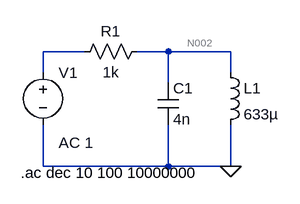
[diagram p0: schematic Task4.asc]
Task4.asc, the LTspice schematic file:
Version 4
SHEET 1 880 680
WIRE 128 32 64 32
WIRE 256 32 208 32
WIRE 352 32 256 32
WIRE 64 64 64 32
WIRE 352 64 352 32
WIRE 256 80 256 32
WIRE 64 208 64 144
WIRE 256 208 256 144
WIRE 256 208 64 208
WIRE 352 208 352 144
WIRE 352 208 256 208
FLAG 352 208 0
SYMBOL res 224 16 R90
WINDOW 0 0 56 VBottom 2
WINDOW 3 32 56 VTop 2
SYMATTR InstName R1
SYMATTR Value 1k
SYMBOL cap 240 80 R0
SYMATTR InstName C1
SYMATTR Value 4n
SYMBOL ind 336 48 R0
SYMATTR InstName L1
SYMATTR Value 633µ
SYMBOL voltage 64 48 R0
WINDOW 123 24 124 Left 2
WINDOW 39 0 0 Left 0
SYMATTR InstName V1
SYMATTR Value ""
SYMATTR Value2 AC 1
TEXT 30 218 Left 2 !.ac dec 10 100 10000000

The netlist it stands for:
* Task4.asc
R1 N002 N001 1k
C1 N002 0 4n
L1 N002 0 633µ
V1 N001 0 AC 1
.ac dec 10 100 10000000
.backanno
.end

* Results of the author's LTspice run, read from the files saved beside the schematic
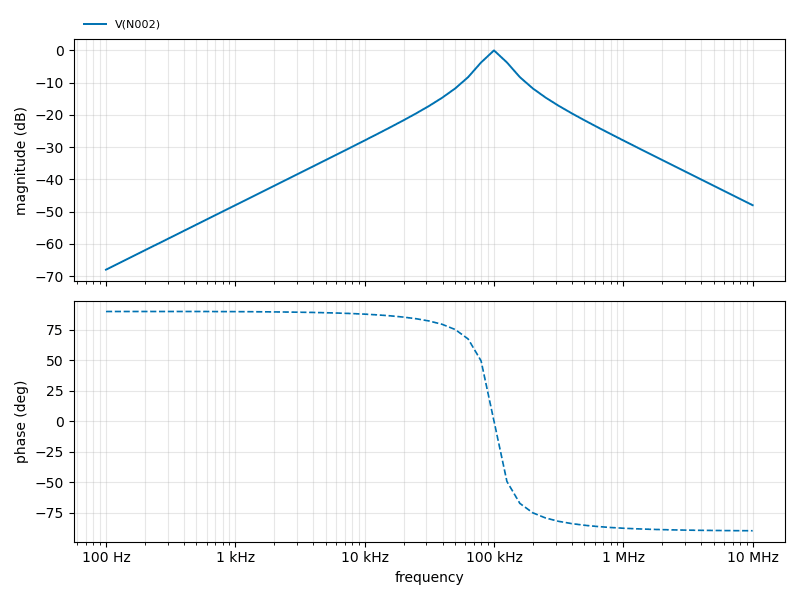
[diagram p1: AC Analysis of Task4.asc, plotted from the saved traces]
* AC Analysis, 1 run:
*   V(N002): -68.01 dB at 100 Hz, -48.00 dB at 10 MHz, peak -0.00 dB at 100 kHz, 3 dB below the peak at 83.09 kHz and 120.4 kHz